# Altium schematic sheet On Board Terminal.SchDoc
size 297 x 209 mm; SheetNumber: 4; SheetTotal: 4
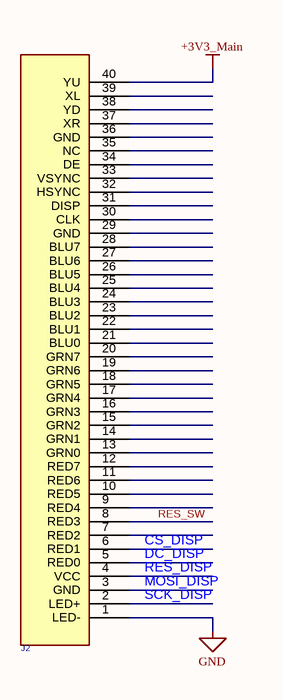
[diagram p0: On Board Terminal.SchDoc]

## Parts
J2  FPC50 40  [FPC50_40]  (value not drawn)

## Nets
+3V3_Main: J2.40(YU)
GND: J2.1(LED-)
CS_DISP: J2.6(RED1)
DC_DISP: J2.5(RED0)
MOSI_DISP: J2.3(GND)
RES_DISP: J2.4(VCC)
RES_SW: J2.8(RED3)
SCK_DISP: J2.2(LED+)

Not connected (* = marked no-connect by the designer): J2 7(RED2) 9(RED4) 10(RED5) 11(RED6) 12(RED7) 13(GRN0) 14(GRN1) 15(GRN2) 16(GRN3) 17(GRN4) 18(GRN5) 19(GRN6) 20(GRN7) 21(BLU0) 22(BLU1) 23(BLU2) 24(BLU3) 25(BLU4) 26(BLU5) 27(BLU6) 28(BLU7) 29(GND) 30(CLK) 31(DISP) 32(HSYNC) 33(VSYNC) 34(DE) 35(NC) 36(GND) 37(XR) 38(YD) 39(XL)

## Notes on the sheet
- Drawn
- Name
- Date
- Drawing Title
- Checked
- Drawing No.
- Approved
- Size
- A4
- Ver.
- Rev.
- Sheet
- Of

## Library data of the parts
J2 = FPC50 40: CONN, FPC, 0.50mm pitch, RightAngle, Bot. Contact; ComponentLink1Description: Website Smart World; ComponentLink1URL: https://www.smartw.ir/; ComponentLink2Description: Telegram; ComponentLink2URL: https://t.me/altium_smartw; ComponentLink3Description: Instagram; ComponentLink3URL: https://Instagram.com/smartgw.ir; DatasheetVersion: 2021